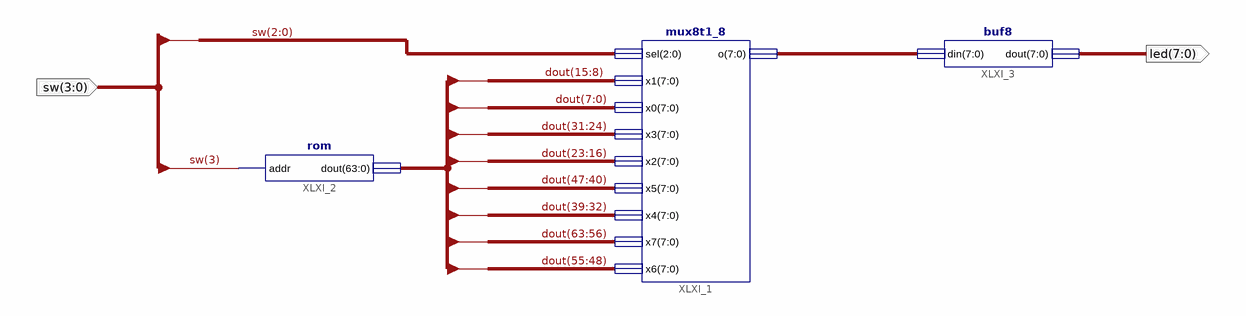
[diagram p0: schematic sheet 1]
// Xilinx ISE schematic top_mux.sch (kintex7) as structural Verilog: 3 symbols, 2 ports
module top_mux (
  input  [3:0] sw,
  output [7:0] led
);

  wire [7:0] XLXN_2;
  wire [63:0] dout;

  mux8t1_8 XLXI_1 (
    .sel(sw[2:0]), .x1(dout[15:8]), .x0(dout[7:0]), .x3(dout[31:24]), .x2(dout[23:16]), .x5(dout[47:40]),
    .x4(dout[39:32]), .x7(dout[63:56]), .x6(dout[55:48]), .o(XLXN_2));
  rom XLXI_2 (.addr(sw[3]), .dout(dout));
  buf8 XLXI_3 (.din(XLXN_2), .dout(led));
endmodule
